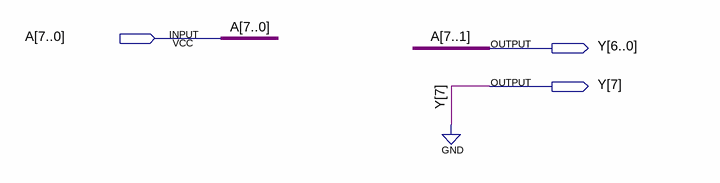
[diagram p0: schematic sheet]
// Quartus schematic 1BitRightShift.bdf as structural Verilog: 0 symbols, 3 pins
module \1BitRightShift  (
  input  [7:0] A,
  output [7:0] Y
);


  assign Y = {1'b0, A[7:1]};
endmodule
